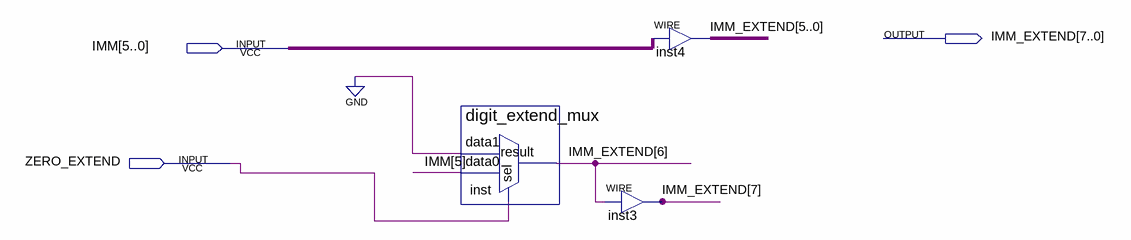
[diagram p0: schematic sheet]
// Quartus schematic Extender.bdf as structural Verilog: 3 symbols, 3 pins
module Extender (
  input  [5:0] IMM,
  input  ZERO_EXTEND,
  output [7:0] IMM_EXTEND
);

  digit_extend_mux inst (.data1(1'b0), .data0(IMM[5]), .sel(ZERO_EXTEND), .result(IMM_EXTEND[6]));
  assign IMM_EXTEND[7] = IMM_EXTEND[6];  // WIRE inst3
  assign IMM_EXTEND[5:0] = IMM;  // WIRE inst4
endmodule
